# EAGLE design Carrier Board (EAGLE 9.6.1)

## Sheet 1 of 3: Sensors
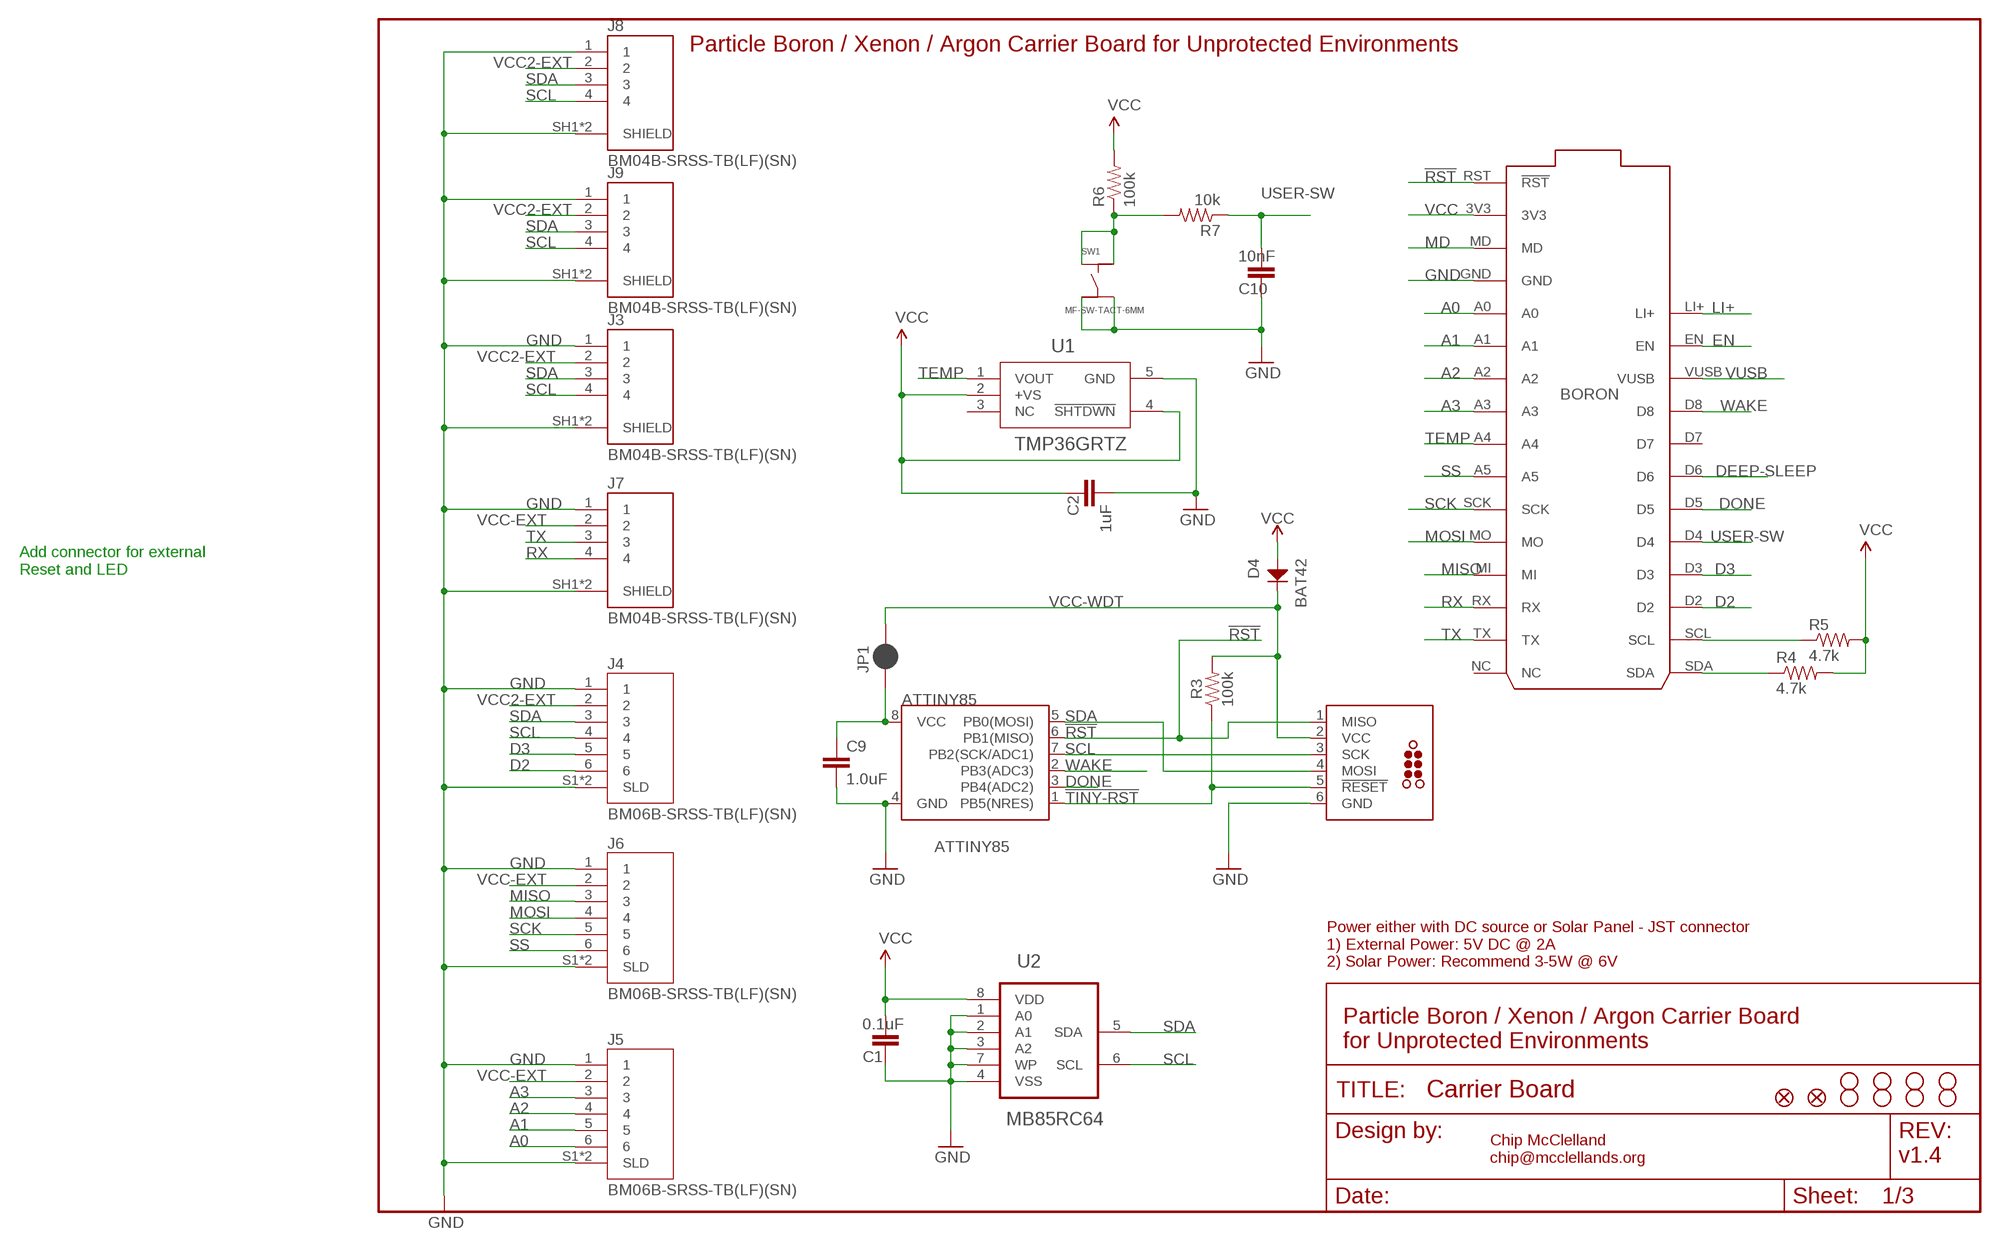
[diagram p0: schematic, sheet 1]

### Parts
ATTINY85  ATTINY85  ATTINY45  [SO08-EIAJ]
C1  0.1uF  CAP0805  [0805@1]
C2  1uF  CAP0805  [0805@1]
C9  1.0uF  1.0UF-0805-25V-10%  [0805]
C10  10nF  CAP0805  [0805@1]
D4  BAT42  DIODES_BAT42_SOD-123  [SOD-123]
FD1  FIDUCIALUFIDUCIAL  [FIDUCIAL-MICRO]
FD2  FIDUCIALUFIDUCIAL  [FIDUCIAL-MICRO]
FRAME1  FRAME-LETTER  [CREATIVE_COMMONS]
H1  STAND-OFF-M2.5  [STAND-OFF-M2.5]
H2  STAND-OFF-M2.5  [STAND-OFF-M2.5]
H3  STAND-OFF-M2.5  [STAND-OFF-M2.5]
H4  STAND-OFF-M2.5  [STAND-OFF-M2.5]
ICSP  TCP2030-MCP-NL  [TC2030-MCP-NL]
J3  BM04B-SRSS-TB(LF)(SN)  BM04B-SRSS-TBT(LF)(SN)  [CONN_BM04B-SRSS-TBT(LF)(SN)]
J4  BM06B-SRSS-TB(LF)(SN)  [JST_BM06B-SRSS-TB(LF)(SN)]
J5  BM06B-SRSS-TB(LF)(SN)  [JST_BM06B-SRSS-TB(LF)(SN)]
J6  BM06B-SRSS-TB(LF)(SN)  [JST_BM06B-SRSS-TB(LF)(SN)]
J7  BM04B-SRSS-TB(LF)(SN)  BM04B-SRSS-TBT(LF)(SN)  [CONN_BM04B-SRSS-TBT(LF)(SN)]
J8  BM04B-SRSS-TB(LF)(SN)  BM04B-SRSS-TBT(LF)(SN)  [CONN_BM04B-SRSS-TBT(LF)(SN)]
J9  BM04B-SRSS-TB(LF)(SN)  BM04B-SRSS-TBT(LF)(SN)  [CONN_BM04B-SRSS-TBT(LF)(SN)]
JP1  JUMPER-SMT_2_NC_PASTE_SILK  [SMT-JUMPER_2_NC_PASTE_SILK]
JP3  STAND-OFF  [STAND-OFF]
JP4  STAND-OFF  [STAND-OFF]
JP5  STAND-OFF  [STAND-OFF]
JP6  STAND-OFF  [STAND-OFF]
P1  Particle Boron / Xenon / Argon  PARTICLE-DEVICES-BORON  [PARTICLE-DEVICES_BORON]
R3  100k  0.3OHM-0805-1/8W-1%  [0805]
R4  4.7k  RESISTOR0805-RES  [0805]
R5  4.7k  RESISTOR0805-RES  [0805]
R6  100k  RESISTOR0805-RES  [0805]
R7  10k  RESISTOR0805-RES  [0805]
SW1  MF-SW-TACT-6MM  TACT_6MM  [TACT6MM]
U1  TMP36GRTZ  TMP36GRTZ-REEL7  [RJ_5]
U2  MB85RC64  MB85RC128PNF-G-JNE1  [SOIC127P600X175-8N]

### Nets
!RST: ATTINY85.6(PB1(MISO)) ICSP.1(MISO) P1.RST(!RST)
!TINY-RST: ATTINY85.1(PB5(NRES)) ICSP.5(!RESET) R3.1
A0: J5.6 P1.A0
A1: J5.5 P1.A1
A2: J5.4 P1.A2
A3: J5.3 P1.A3
D2: J4.6 P1.D2 ; also sheet 2
D3: J4.5 P1.D3 ; also sheet 2
DEEP-SLEEP: P1.D6
DONE: ATTINY85.3(PB4(ADC2)) P1.D5
EN: P1.EN ; also sheet 3
GND: ATTINY85.4(GND) C1.2 C2.2 C9.2 C10.2 ICSP.6(GND) J3.1 J3.SH1(SHIELD) J3.SH2(SHIELD) J4.1 J4.S1(SLD) J4.S2(SLD) J5.1 J5.S1(SLD) J5.S2(SLD) J6.1 J6.S1(SLD) J6.S2(SLD) J7.1 J7.SH1(SHIELD) J7.SH2(SHIELD) J8.1 J8.SH1(SHIELD) J8.SH2(SHIELD) J9.1 J9.SH1(SHIELD) J9.SH2(SHIELD) P1.GND SW1.P$3 SW1.P$4 U1.5(GND) U2.1(A0) U2.2(A1) U2.3(A2) U2.4(VSS) U2.7(WP) ; also sheet 2,3
LI+: P1.LI+ ; also sheet 2
MD: P1.MD
MISO: J6.3 P1.MI
MOSI: J6.4 P1.MO
N$4: R6.1 R7.2 SW1.P$1 SW1.P$2
N$8: ATTINY85.8(VCC) C9.1 JP1.1
RX: J7.4 P1.RX
SCK: J6.5 P1.SCK
SCL: ATTINY85.7(PB2(SCK/ADC1)) ICSP.3(SCK) J3.4 J4.4 J8.4 J9.4 P1.SCL R5.1 U2.6(SCL) ; also sheet 2,3
SDA: ATTINY85.5(PB0(MOSI)) ICSP.4(MOSI) J3.3 J4.3 J8.3 J9.3 P1.SDA R4.1 U2.5(SDA) ; also sheet 2,3
SS: J6.6 P1.A5
TEMP: P1.A4 U1.1(VOUT)
TX: J7.3 P1.TX
USER-SW: C10.1 P1.D4 R7.1
VCC: C1.1 C2.1 D4.ANODE P1.3V3 R4.2 R5.2 R6.2 U1.2(+VS) U1.4(!SHTDWN) U2.8(VDD) ; also sheet 2,3
VCC2-EXT: J3.2 J4.2 J8.2 J9.2 ; also sheet 2
VCC-EXT: J5.2 J6.2 J7.2 ; also sheet 2
VCC-WDT: D4.CATHODE ICSP.2(VCC) JP1.2 R3.2
VUSB: P1.VUSB ; also sheet 2
WAKE: ATTINY85.2(PB3(ADC3)) P1.D8
Unconnected: P1.D7 P1.NC U1.3(NC)

### Notes on the sheet
- Particle Boron / Xenon / Argon Carrier Board for Unprotected Environments
- Add connector for external 
  Reset and LED
- Power either with DC source or Solar Panel - JST connector
  1) External Power: 5V DC @ 2A 
  2) Solar Power: Recommend 3-5W @ 6V
- Particle Boron / Xenon / Argon Carrier Board
  for Unprotected Environments
- Chip McClelland
  chip@mcclellands.org
- v1.4

## Sheet 2 of 3: Power Control
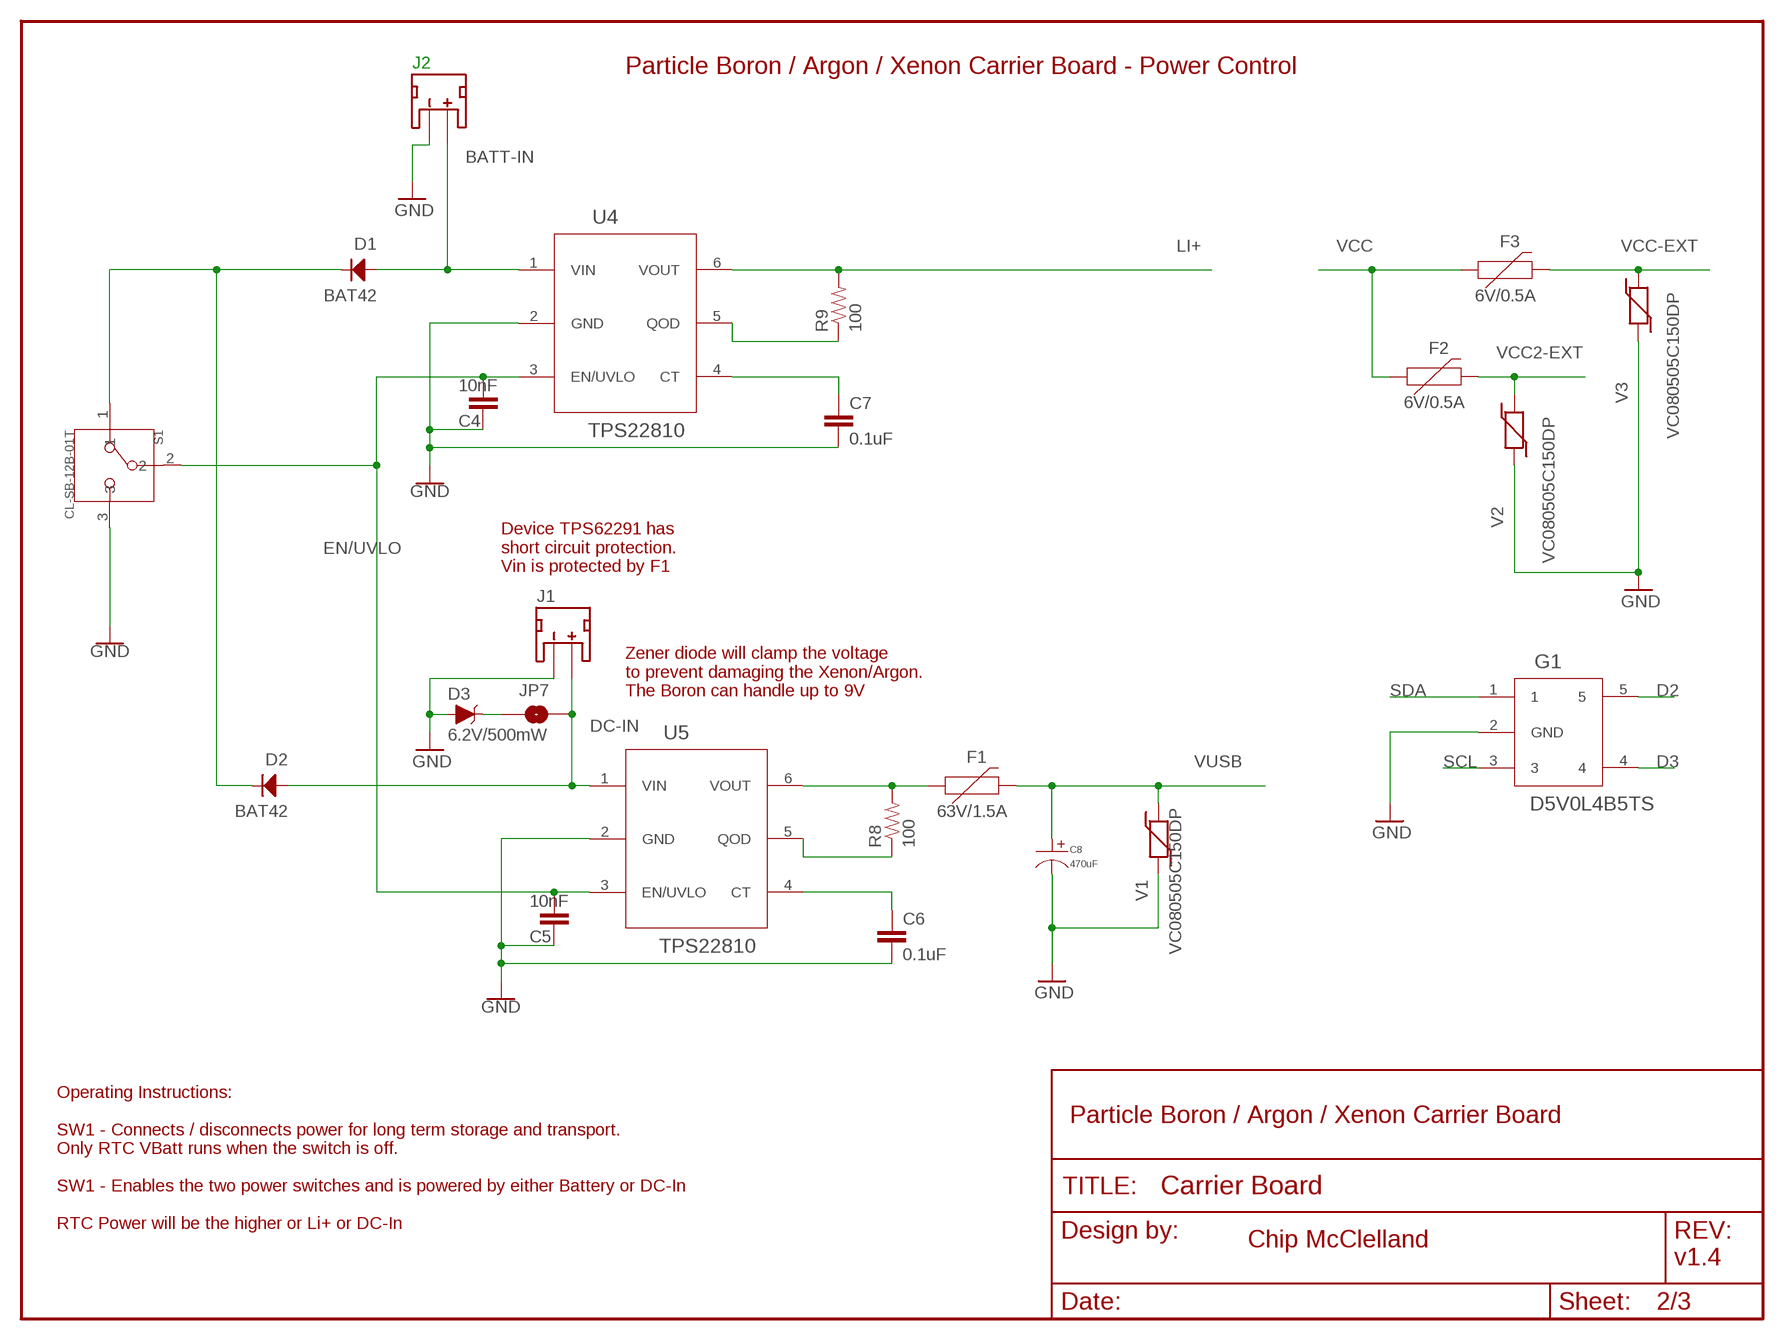
[diagram p1: schematic, sheet 2]

### Parts
C4  10nF  CAP0805  [0805@1]
C5  10nF  CAP0805  [0805@1]
C6  0.1uF  CAP0805  [0805@1]
C7  0.1uF  CAP0805  [0805@1]
C8  470uF  CAPACITOR_P_10MM  [CP10MM]
D1  BAT42  DIODES_BAT42_SOD-123  [SOD-123]
D2  BAT42  DIODES_BAT42_SOD-123  [SOD-123]
D3  6.2V/500mW  DIODE-ZENER-DZ2J150M0L  [PANASONIC_SMINI2-F5-B]
F1  63V/1.5A  PPTC_HALF-AMP  [1206]
F2  6V/0.5A  PPTC_HALF-AMP  [1206]
F3  6V/0.5A  PPTC_HALF-AMP  [1206]
FRAME2  FRAME-LETTER  [CREATIVE_COMMONS]
G1  D5V0L4B5TS  [SOT-23-5]
J1  S2B-PH-SM4-TB(LF)(SN)  JST_2MM_MALE  [JST-2-SMD]
J2  S2B-PH-SM4-TB(LF)(SN)  JST_2MM_MALE  [JST-2-SMD]
JP7  JUMPER-SMT_2_NO_SILK  [SMT-JUMPER_2_NO_SILK]
R8  100  RESISTOR0805-RES  [0805]
R9  100  RESISTOR0805-RES  [0805]
S1  CL-SB-12B-01T  [CL-SB-12B]
U4  TPS22810  [SOT-23-6]
U5  TPS22810  [SOT-23-6]
V1  VC080505C150DP  VARISTOR  [0805]
V2  VC080505C150DP  VARISTOR  [0805]
V3  VC080505C150DP  VARISTOR  [0805]

### Nets
BATT-IN: D1.ANODE J2.2(+) U4.1(VIN) ; also sheet 3
D2: G1.5 ; also sheet 1
D3: G1.4 ; also sheet 1
DC-IN: D2.ANODE J1.2(+) JP7.1 U5.1(VIN)
EN/UVLO: C4.1 C5.1 S1.2 U4.3(EN/UVLO) U5.3(EN/UVLO)
GND: C4.2 C5.2 C6.2 C7.2 C8.P$2 D3.A G1.2(GND) J1.1(-) J2.1(-) S1.3 U4.2(GND) U5.2(GND) V1.1 V2.1 V3.1 ; also sheet 1,3
LI+: R9.2 U4.6(VOUT) ; also sheet 1
N$1: D3.C JP7.2
N$5: C6.1 U5.4(CT)
N$6: R8.1 U5.5(QOD)
N$7: F1.1 R8.2 U5.6(VOUT)
N$9: D1.CATHODE D2.CATHODE S1.1
N$10: C7.1 U4.4(CT)
N$12: R9.1 U4.5(QOD)
SCL: G1.3 ; also sheet 1,3
SDA: G1.1 ; also sheet 1,3
VCC: F2.1 F3.1 ; also sheet 1,3
VCC2-EXT: F2.2 V2.2 ; also sheet 1
VCC-EXT: F3.2 V3.2 ; also sheet 1
VUSB: C8.P$1 F1.2 V1.2 ; also sheet 1
Unconnected: J1.NC1(PAD1) J1.NC2(PAD2) J2.NC1(PAD1) J2.NC2(PAD2)

### Notes on the sheet
- Particle Boron / Argon / Xenon Carrier Board - Power Control
- Device TPS62291 has 
  short circuit protection. 
  Vin is protected by F1
- Zener diode will clamp the voltage
  to prevent damaging the Xenon/Argon.  
  The Boron can handle up to 9V
- Particle Boron / Argon / Xenon Carrier Board
- Operating Instructions:
  
  SW1 - Connects / disconnects power for long term storage and transport.  
  Only RTC VBatt runs when the switch is off.
  
  SW1 - Enables the two power switches and is powered by either Battery or DC-In
  
  RTC Power will be the higher or Li+ or DC-In
- Chip McClelland
- v1.4

## Sheet 3 of 3: Real Time Clock
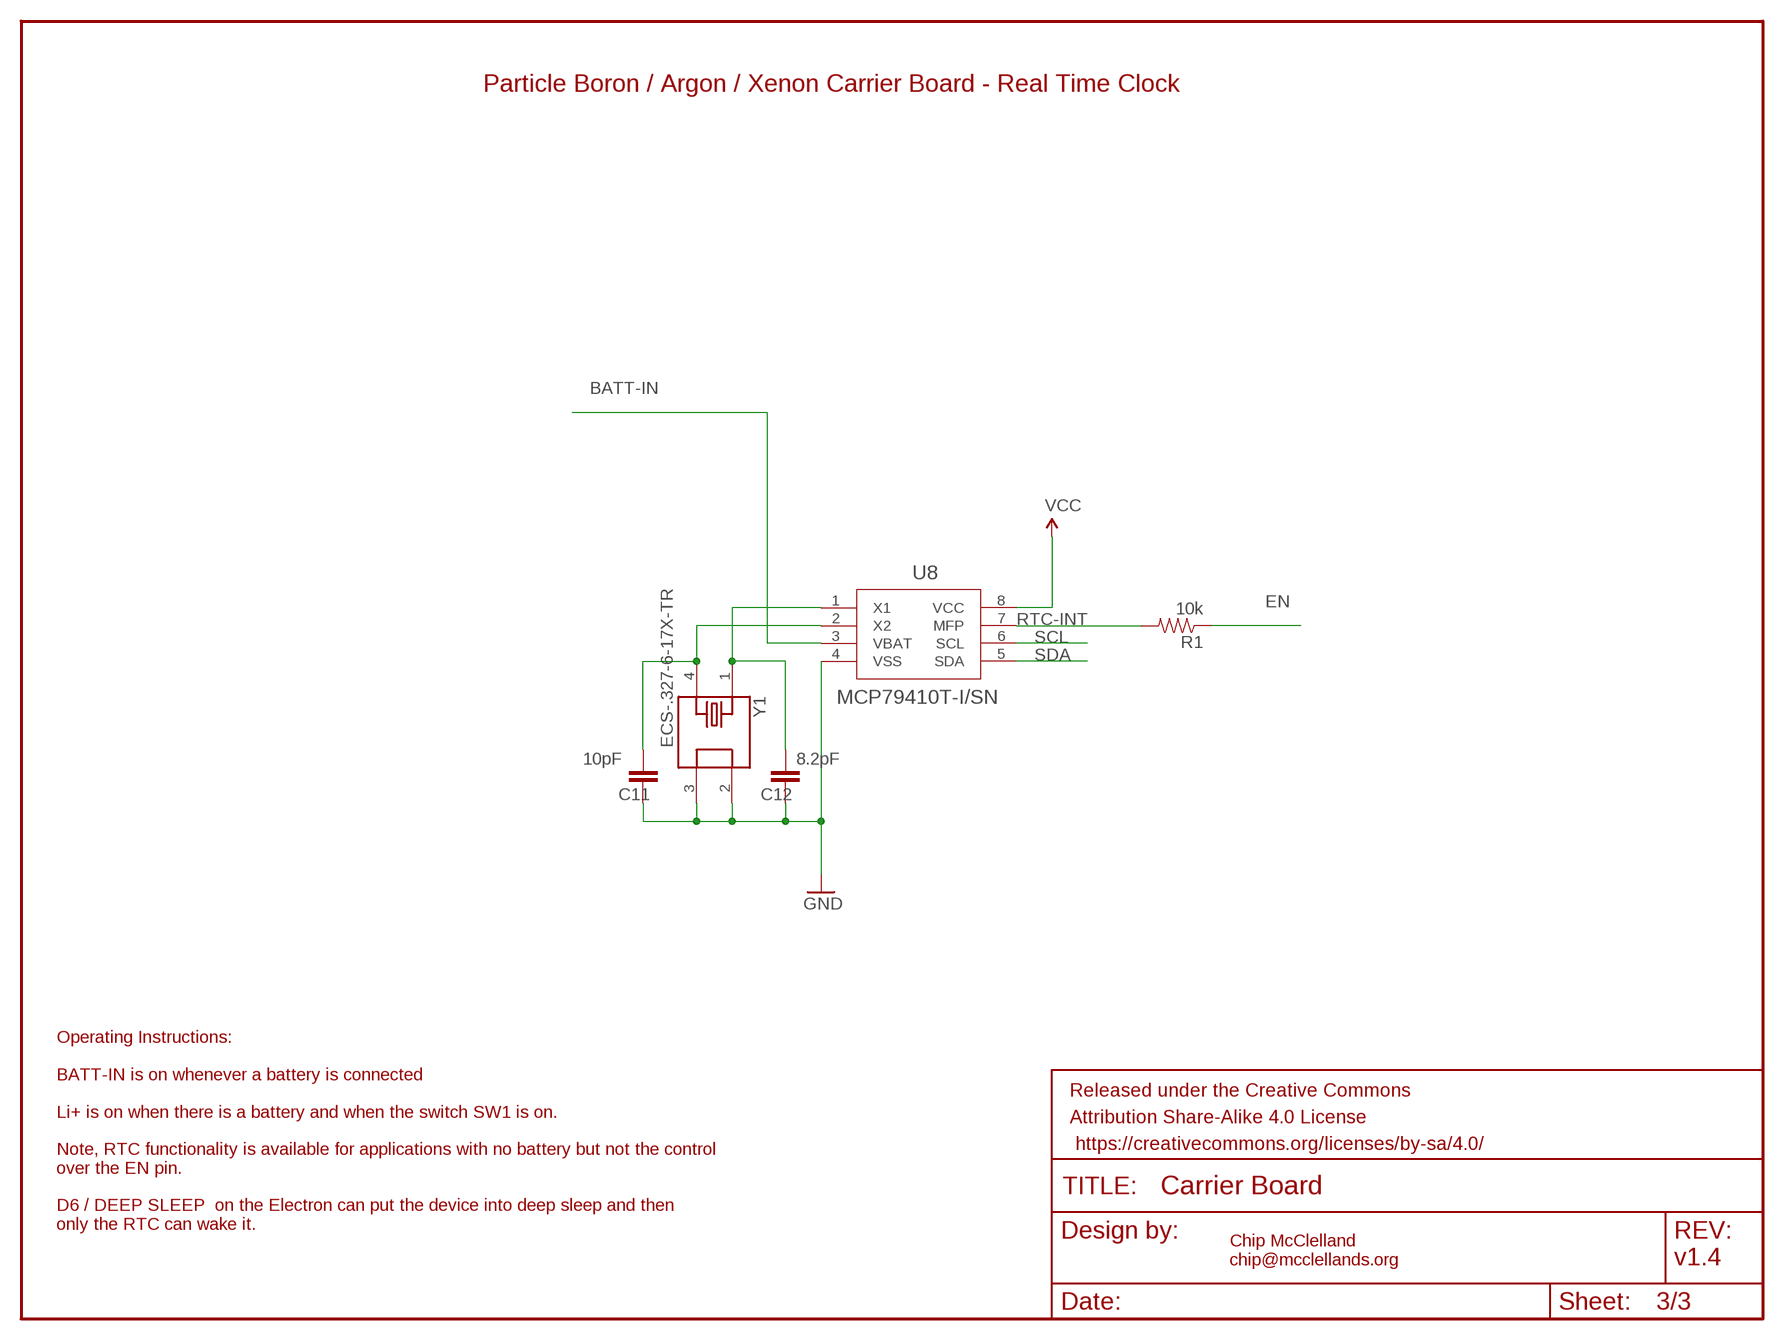
[diagram p2: schematic, sheet 3]

### Parts
C11  10pF  CAP0805  [0805@1]
C12  8.2pF  CAP0805  [0805@1]
FRAME3  FRAME-LETTER  [CREATIVE_COMMONS]
R1  10k  RESISTOR0805-RES  [0805]
U8  MCP79410T-I/SN  [SOIC8-N_MC]
Y1  ECS-.327-6-17X-TR  [XTAL_ECS-.327-6-17X-TR]

### Nets
BATT-IN: U8.3(VBAT) ; also sheet 2
EN: R1.1 ; also sheet 1
GND: C11.2 C12.2 U8.4(VSS) Y1.2 Y1.3 ; also sheet 1,2
N$15: C12.1 U8.1(X1) Y1.1
N$16: C11.1 U8.2(X2) Y1.4
RTC-INT: R1.2 U8.7(MFP)
SCL: U8.6(SCL) ; also sheet 1,2
SDA: U8.5(SDA) ; also sheet 1,2
VCC: U8.8(VCC) ; also sheet 1,2

### Notes on the sheet
- Particle Boron / Argon / Xenon Carrier Board - Real Time Clock
- Operating Instructions:
  
  BATT-IN is on whenever a battery is connected
  
  Li+ is on when there is a battery and when the switch SW1 is on.
  
  Note, RTC functionality is available for applications with no battery but not the control
  over the EN pin.
  
  D6 / DEEP SLEEP  on the Electron can put the device into deep sleep and then 
  only the RTC can wake it.
- Chip McClelland
  chip@mcclellands.org
- v1.4

## Library data of the parts
ATTINY85 = SparkFun:ATTINY45: Atmel ATTiny45; MPN: ATTINY85-20SUR
C1 = SparkFun-Capacitors:CAP: Capacitor Standard 0603 ceramic capacitor, and 0.1" leaded capacitor.; HOUSEPART: YES; MPN: MF-CAP-0805-0.1uF; POPULATE: 1
C2 = SparkFun-Capacitors:CAP: Capacitor Standard 0603 ceramic capacitor, and 0.1" leaded capacitor.; MPN: MF-CAP-0805-1uF
C4 C5 C10 = SparkFun-Capacitors:CAP: Capacitor Standard 0603 ceramic capacitor, and 0.1" leaded capacitor.; HOUSEPART: No; MPN: 08051C103K4T2A; POPULATE: 1
C6 C7 = SparkFun-Capacitors:CAP: Capacitor Standard 0603 ceramic capacitor, and 0.1" leaded capacitor.; HOUSEPART: Yes; MPN: MF-CAP-0805-0.1uF
C8 = MF_Passives:CAPACITOR_P: Library: MF_Passives Description: Device for Polarized Capacitors. Manufacture part number (MPN), Voltage Rating, and Tolerance can be added via Attributes. Check https://factory.macrofab.com/parts for the house parts list.; HOUSEPART: 1; MPN: MF-CAP-10MM-470uF; POPULATE: 1
C9 = SparkFun-Capacitors:1.0UF: 1µF ceramic capacitors A capacitor is a passive two-terminal electrical component used to store electrical energy temporarily in an electric field.; MPN: MF-CAP-0805-0.1uF; PROD_ID: CAP-08064
C11 = SparkFun-Capacitors:CAP: Capacitor Standard 0603 ceramic capacitor, and 0.1" leaded capacitor.; HOUSEPART: No; MPN: C0805C100JDGACTU‎; POPULATE: 1
C12 = SparkFun-Capacitors:CAP: Capacitor Standard 0603 ceramic capacitor, and 0.1" leaded capacitor.; HOUSEPART: No; MPN: C0805C829D5GACTU‎; POPULATE: 1
D1 D2 D4 = MF_Discrete_Semiconductor:DIODES: Library: MF_Discrete_Semiconductor Description: Device for Single Packaged Diodes.; HOUSEPART: YES; MPN: MF-DIO-SOD123-BAT42; POPULATE: 1; URL: https://factory.macrofab.com/part/MF-DIO-SOD123-BAT42; VALUE: MF-DIO-SOD123-BAT42
D3 = SparkFun-DiscreteSemi:DIODE-ZENER: Zener Diode A Zener diode allows current to flow from its anode to its cathode like a normal semiconductor diode, but it also permits current to flow in the reverse direction when its "Zener voltage" is reached. - WIkipedia; MPN: TDZ6V2J,115; POPULATE: 1; PROD_ID: DIO-12989; VALUE: 15V
F1 = SparkFun-Fuses:PPTC: Resettable Fuse PPTC Resettable Fuse. Really a sort of resistor with a polymeric positive temperature coefficient whose resistance increases dramatically with an increase in temperature. When heated by the power passing through the resistance rises causing the current to be limited, protecting the circuit. This is achieved by the transition of the polymer from a crystalline to an amorphous state where the conductive carbon separates breaking the conductive pathways found in the cool crystalline structure. When a PPTC cools back down it resumes conducting letting the circuit turn back on. SparkFun Products: SparkFun RedBoard - Programmed with Arduino <https://www.sparkfun.com/products/12757> Pro Micro - 5V/16MHz <https://www.sparkfun.com/products/12640> Arduino Pro 328 - 5V/16MHz <https://www.sparkfun.com/products/10915> MP3 Trigger <https://www.sparkfun.com/products/13720>; MPN: 046801.5NR; PROD_ID: RES-08585; VALUE: 6V/0.5A
F2 F3 = SparkFun-Fuses:PPTC: Resettable Fuse PPTC Resettable Fuse. Really a sort of resistor with a polymeric positive temperature coefficient whose resistance increases dramatically with an increase in temperature. When heated by the power passing through the resistance rises causing the current to be limited, protecting the circuit. This is achieved by the transition of the polymer from a crystalline to an amorphous state where the conductive carbon separates breaking the conductive pathways found in the cool crystalline structure. When a PPTC cools back down it resumes conducting letting the circuit turn back on. SparkFun Products: SparkFun RedBoard - Programmed with Arduino <https://www.sparkfun.com/products/12757> Pro Micro - 5V/16MHz <https://www.sparkfun.com/products/12640> Arduino Pro 328 - 5V/16MHz <https://www.sparkfun.com/products/10915> MP3 Trigger <https://www.sparkfun.com/products/13720>; MPN: 0466.500NR; PROD_ID: RES-08585
FD1 FD2 = SparkFun-Aesthetics:FIDUCIAL: Fiducial Alignment Points Point-of-reference for pick-and-place machines and other optical instruments.; POPULATE: 0
FRAME1-FRAME3 = SparkFun-Aesthetics:FRAME-LETTER: Schematic Frame - Letter Standard 8.5x11 US Letter frame; POPULATE: 0
G1 = Custom Components:D5V0L4B5TS: 4 CHANNEL LOW CAPACITANCE BI-DIRECTIONAL TVS ARRAY; MPN: D5V0L4B5TS-7
H1-H4 = Custom Components:STAND-OFF-M2.5: Stand Off Drill holes for mechanically mounting via screws, standoffs, etc. Note: Use the keepout ring to avoid running the screw head into surrounding components. Variant Overviews STAND-OFF - Mechanical footprint for a M2.5 phillips button head screw. STAND-OFF-TIGHT - Mechanical footprint for a M2.5 phillips button head screw, Example SparkFun Products; POPULATE: 0
ICSP = Custom Components:TCP2030-MCP-NL; POPULATE: 0
J1 J2 = SparkFun-Connectors:JST_2MM_MALE: JST 2MM MALE RA CONNECTOR Two pin, compact surface mount connector. Commonly used as a battery input connection point. We really like the solid locking feeling and high current rating on these small connectors. We use these all the time as battery connectors. Mates to single-cell LiPo batteries. Here is the connector we sell at SparkFun: JST Right Angle Connector - White <https://www.sparkfun.com/products/8612> (PRT-08612) Datasheet <http://www.sparkfun.com/datasheets/Prototyping/Connectors/JST-Horizontal.pdf> It was used on these SparkFun products: SparkFun MOSFET Power Controller <https://www.sparkfun.com/products/11214> (PRT-11214) SparkFun Battery Babysitter - LiPo Battery Manager <https://www.sparkfun.com/products/13777> (PRT-13777) And many, many others that required a lipo battery connection.; MFG: JST S2B-PH-SM4-TB(LF)(SN); PROD_ID: CONN-11443; SF_ID: PRT-08612
J3 J7-J9 = Custom Components:BM04B-SRSS-TBT(LF)(SN): 1.0mm Pitch, Ultra-Compact, Low Profile Design, Interchangeable Shrouded Header; AVAILABILITY: Unavailable; DESCRIPTION: 1.0mm Pitch, Ultra-Compact, Low Profile Design, Interchangeable Shrouded Header; MF: JST Sales; MP: BM04B-SRSS-TB_LF__SN_; PACKAGE: None; PRICE: None
J4-J6 = Custom Components:BM06B-SRSS-TB(LF)(SN): 6 Position 1.0mm Top-Entry Surface Mount Shrouded Header; MPN: BM06B-SRSS-TB(LF)(SN); POPULATE: 1
JP1 = SparkFun-Jumpers:JUMPER-SMT_2_NC_PASTE: Normally closed solder jumper This jumper has an aperture in the stencil to allow solder paste to bridge the split in the wire so it's normally closed (NC). Wick off the solder to open the connection. Reapply solder to reclose the connection.; POPULATE: 0
JP3-JP6 = SparkFun-Hardware:STAND-OFF: Stand Off Drill holes for mechanically mounting via screws, standoffs, etc. Note: Use the keepout ring to avoid running the screw head into surrounding components. Variant Overviews STAND-OFF - Mechanical footprint for a #4 phillips button head screw. STAND-OFF-TIGHT - Mechanical footprint for a #4 phillips button head screw, Example SparkFun Products Screw - Phillips Head (1/4", 4-40, 10 pack) <https://www.sparkfun.com/products/10453> (PRT-10453) Screw - Phillips Head (1/2", 4-40, 10 pack) <https://www.sparkfun.com/products/10452> (PRT-10452) Screw - Phillips Head (3/4", 4-40, 10 pack) <https://www.sparkfun.com/products/10451> (PRT-10451) Screw - Phillips Head (1", 4-40, 10 pack) <https://www.sparkfun.com/products/10450> (PRT-10450); POPULATE: 0
JP7 = SparkFun-Jumpers:JUMPER-SMT_2_NO: Normally open jumper This jumper has two pads in close proximity to each other. Apply solder to close the connection. Round pads are easier to solder for beginners, but are a lot larger. SparkFun Product that uses the round pads: SparkFun EL Sequencer <https://www.sparkfun.com/products/12781>; POPULATE: 0
P1 = Carrier Board:PARTICLE-DEVICES-BORON: Particle Boron Device for Carrier Board Placement; POPULATE: 0
R1 R7 = SparkFun-Passives:RESISTOR: Resistor Basic schematic elements and footprints for 0603, 1206, and PTH resistors.; HOUSEPART: YES; MPN: MF-RES-0805-10K
R3 = SparkFun-Resistors:0.3OHM: 0.3Ω resistor A resistor is a passive two-terminal electrical component that implements electrical resistance as a circuit element. Resistors act to reduce current flow, and, at the same time, act to lower voltage levels within circuits. - Wikipedia; MPN: MF-RES-0805-100K; PROD_ID: RES-11622; VALUE: 0.3
R4 R5 = SparkFun-Passives:RESISTOR: Resistor Basic schematic elements and footprints for 0603, 1206, and PTH resistors.; MPN: MF-RES-0805-4.7K
R6 = SparkFun-Passives:RESISTOR: Resistor Basic schematic elements and footprints for 0603, 1206, and PTH resistors.; HOUSEPART: YES; MPN: MF-RES-0805-100K
R8 R9 = SparkFun-Passives:RESISTOR: Resistor Basic schematic elements and footprints for 0603, 1206, and PTH resistors.; HOUSEPART: Yes; MPN: MF-RES-0805-100
S1 = Custom Components:CL-SB-12B-01T; DESCRIPTION: Switch Slide N.O./N.C. SPDT Top Slide 0.2A 12VDC Gull Wing SMD T/R; DIGI-KEY_PART_NUMBER: 563-1318-1-ND; DIGI-KEY_PURCHASE_URL: https://www.digikey.com/product-detail/en/nidec-copal-electronics/CL-SB-12B-01T/563-1318-1-ND/3507878?utm_source=snapeda&utm_medium=aggregator&utm_campaign=symbol; MF: Nidec Copal; MP: CL-SB-12B-01T; PACKAGE: None
SW1 = MF_Switches:TACT: Library: MF_Switches Description: Device for Tact Switches. Manufacture part number (MFG#) can be added via Attributes.; HOUSEPART: YES; MPN: MF-SW-TACT-6MM; POPULATE: 1; URL: https://factory.macrofab.com/part/MF-SW-TACT-6MM
U1 = TMP36:TMP36GRTZ-REEL7; MANUFACTURER_PART_NUMBER: TMP36GRTZ-REEL7; MPN: TMP36GRTZ-REEL7; VENDOR: Analog Devices Inc
U2 = Fujitsu_By_element14_Batch_1:MB85RC128PNF-G-JNE1: Memory FRAM; MPN: MB85RC64APNF-G-JNERE1; OC_FARNELL: 1831995; OC_NEWARK: 93R5161; PACKAGE: SO-8; SUPPLIER: FUJITSU
U4 U5 = Custom Components:TPS22810: TPS22810, 2.7-18-V, 79-mΩOn-ResistanceLoadSwitchWithThermal Protection; MPN: TPS22810DBVT
U8 = Custom Components:MCP79410T-I/SN; MANUFACTURER_PART_NUMBER: MCP79410TISN; POPULATE: 1; VENDOR: Microchip
V1-V3 = Custom Components:VARISTOR; MPN: VC080505C150DP; POPULATE: 1
Y1 = Custom Components:ECS-.327-6-17X-TR: Crystal 4-SOJ, 5.50mm pitch; DESCRIPTION: ECX-306X Series 32.768 kHz ±20 ppm 6 pF -40 to +85 °C SMT Tuning Fork Crystal; DIGI-KEY_PART_NUMBER: XC1307CT-ND; DIGI-KEY_PURCHASE_URL: https://www.digikey.com/product-detail/en/ecs-inc/ECS-.327-6-17X-TR/XC1307CT-ND/827771?utm_source=snapeda&utm_medium=aggregator&utm_campaign=symbol; MF: ECS Inc.; MP: ECS-.327-6-17X-TR; PACKAGE: 4-4 ECS International

## Net classes
0 default: width 0.203 mm, drill 0.33 mm

## Board
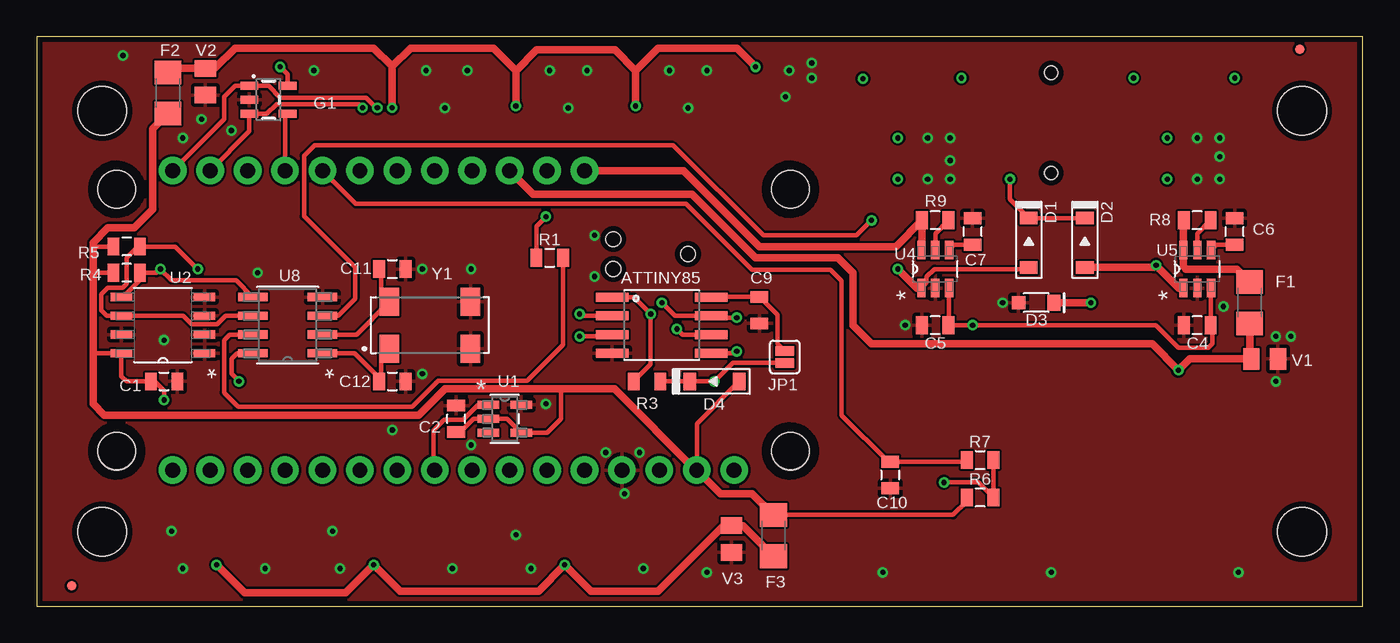
[diagram p3: board, top side]
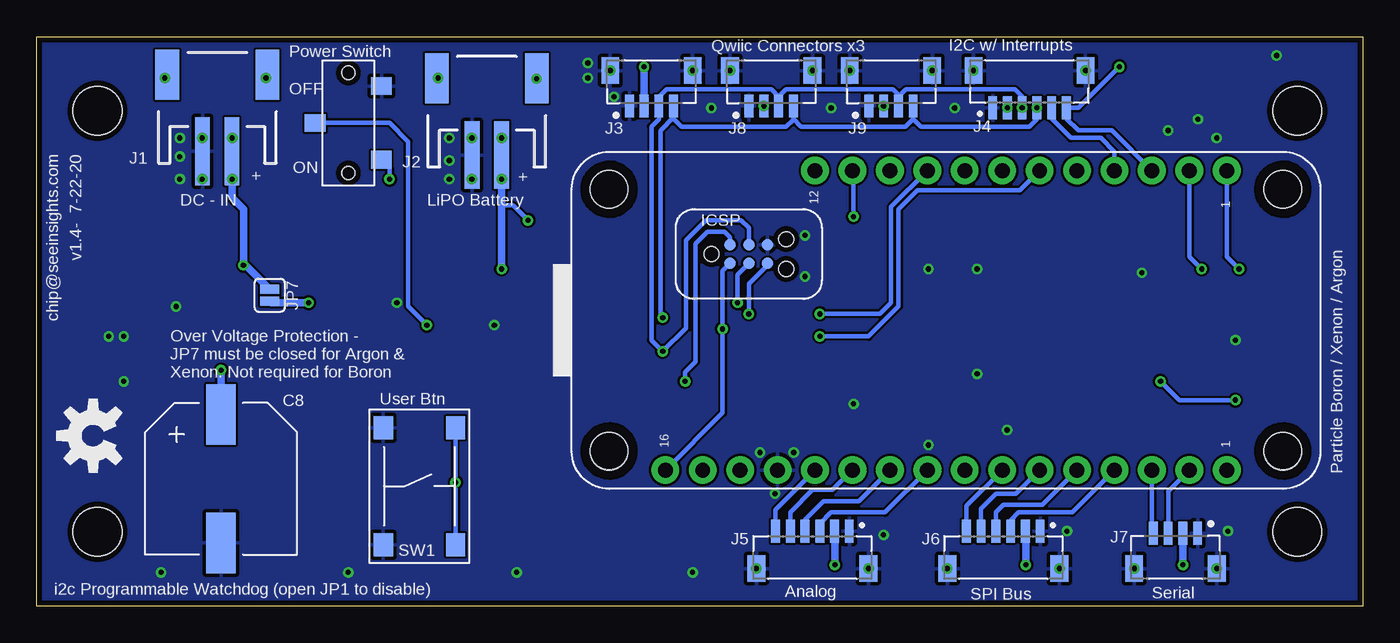
[diagram p4: board, bottom side, seen from below]

Size 89.97 x 38.61 mm. Coordinates in mm from the lower left corner, seen from the top.
Outline: 0,0 89.97,0 89.97,38.61 0,38.61 0,0
Copper layers (1*16): Top 0.0356mm / dielectric 1.5011mm / Bottom 0.0356mm
Design rules "LaenPCBOrder": minimum track width 6mil, minimum drill 13mil, track to track 6mil, track to pad 6mil, pad to pad 6mil, via to via 6mil, smd to smd 6mil, copper to edge 15mil, drill to drill 6mil, minimum pad ring 7mil, minimum via ring 7mil, stop-mask expansion 3mil, vias tented up to drill 0mil, thermal gap 10mil

### Footprints (pad centres in the part's own frame; a part is rotated, then mirrored left to right if it is on the bottom)
SO08-EIAJ = smd 0.61 x 2.21: 1 -1.905,-3.378; 2 -0.635,-3.378; 3 0.635,-3.378; 4 1.905,-3.378; 5 1.905,3.353; 6 0.635,3.353; 7 -0.635,3.353; 8 -1.905,3.353
0805@1 = smd 0.8 x 1.2: 1 -0.9,0; 2 0.9,0
CP10MM = smd 2 x 4.1: P$1 0,-4.35; P$2 0,4.35
0805 = smd 0.8 x 1.2: 1 -0.9,0; 2 0.9,0
SOD-123 = smd 0.85 x 1.2: ANODE 1.675,0; CATHODE -1.675,0
PANASONIC_SMINI2-F5-B = smd 0.9 x 0.9: A 1.2,0 | smd 0.9 x 1.1: C -1.2,0
1206 = smd 1.6 x 1.8: 1 -1.4,0; 2 1.4,0
FIDUCIAL-MICRO = smd 0.635 x 0.635: 1 0,0
SOT-23-5 = smd 0.55 x 1.2: 1 -0.95,-1.3; 2 0,-1.3; 3 0.95,-1.3; 4 0.95,1.3; 5 -0.95,1.3
STAND-OFF-M2.5 = hole 2.54: 0,0
TC2030-MCP-NL = smd 0.787 x 0.787: 1 -1.27,-0.635; 2 -1.27,0.635; 3 0,-0.635; 4 0,0.635; 5 1.27,-0.635; 6 1.27,0.635 | hole 0.991: -2.54,0; 2.54,-1.016; 2.54,1.016
JST-2-SMD = smd 1 x 4.6: 1 -1,-3.7; 2 1,-3.7 | smd 1.6 x 3.4: NC1 -3.4,1.5; NC2 3.4,1.5
CONN_BM04B-SRSS-TBT(LF)(SN) = smd 0.6 x 1.55: 1 -1.5,-2.4; 2 -0.5,-2.4; 3 0.5,-2.4; 4 1.5,-2.4 | smd 1.2 x 1.8: SH1 -2.8,0; SH2 2.8,0
JST_BM06B-SRSS-TB(LF)(SN) = smd 0.6 x 1.55: 1 -2.5,-2.525; 2 -1.5,-2.525; 3 -0.5,-2.525; 4 0.5,-2.525; 5 1.5,-2.525; 6 2.5,-2.525 | smd 1.2 x 1.8: S1 -3.8,0; S2 3.8,0
SMT-JUMPER_2_NC_PASTE_SILK = smd 0.635 x 1.27: 1 -0.406,0; 2 0.406,0
STAND-OFF = hole 3.302: 0,0
SMT-JUMPER_2_NO_SILK = smd 0.635 x 1.27: 1 -0.406,0; 2 0.406,0
PARTICLE-DEVICES_BORON = drill 1.016 pad 1.88: 3V3 1.27,41.91; A0 1.27,34.29; A1 1.27,31.75; A2 1.27,29.21; A3 1.27,26.67; A4 1.27,24.13; A5 1.27,21.59; D2 21.59,11.43; D3 21.59,13.97; D4 21.59,16.51; D5 21.59,19.05; D6 21.59,21.59; D7 21.59,24.13; D8 21.59,26.67; EN 21.59,31.75; GND 1.27,36.83; LI+ 21.59,34.29; MD 1.27,39.37; MI 1.27,13.97; MO 1.27,16.51; NC 1.27,6.35; RST 1.27,44.45; RX 1.27,11.43; SCK 1.27,19.05; SCL 21.59,8.89; SDA 21.59,6.35; TX 1.27,8.89; VUSB 21.59,29.21 | hole 2.54: 2.54,2.54; 20.32,2.54; 20.32,48.26; 2.54,48.26
CL-SB-12B = smd 1.2 x 1.4: 1 -2.5,-2.25; 2 0,2.25; 3 2.5,-2.25 | hole 0.9: 3.4,0; -3.4,0
TACT6MM = smd 1.55 x 1.3: P$1 -3.975,2.45; P$2 3.975,2.45; P$3 -3.975,-2.45; P$4 3.975,-2.45
RJ_5 = smd 1.473 x 0.559: 1 -1.118,0.95; 2 -1.118,0; 3 -1.118,-0.95; 4 1.118,-0.95; 5 1.118,0.95
SOIC127P600X175-8N = smd 1.473 x 0.559: 1 -2.819,1.905; 2 -2.819,0.635; 3 -2.819,-0.635; 4 -2.819,-1.905; 5 2.819,-1.905; 6 2.819,-0.635; 7 2.819,0.635; 8 2.819,1.905
SOT-23-6 = smd 1.27 x 0.559: 1 -1.295,0.94; 2 -1.295,0; 3 -1.295,-0.94; 4 1.295,-0.94; 5 1.295,0; 6 1.295,0.94
SOIC8-N_MC = smd 1.981 x 0.559: 1 -2.362,1.905; 2 -2.362,0.635; 3 -2.362,-0.635; 4 -2.362,-1.905; 5 2.362,-1.905; 6 2.362,-0.635; 7 2.362,0.635; 8 2.362,1.905
0805' = smd 1.118 x 1.448: 1 -0.902,0; 2 0.902,0
XTAL_ECS-.327-6-17X-TR = smd 1.3 x 1.9: 1 -2.75,-1.6; 2 2.75,-1.6; 3 2.75,1.6; 4 -2.75,1.6

### Placement (x,y rotation side)
ATTINY85  42.42,19.05 270 top
C1  8.64,15.24 0 top
C2  28.45,12.7 90 top
C4  78.74,19.05 180 top
C5  60.96,19.05 180 top
C6  81.28,25.4 90 top
C7  63.5,25.4 90 top
C8  77.47,8.64 180 bottom
C9  49.02,20.07 270 top
C10  57.91,8.89 270 top
C11  24.13,22.86 0 top
C12  24.13,15.24 0 top
D1  67.31,24.64 270 top
D2  71.12,24.64 270 top
D3  67.82,20.57 180 top
D4  45.97,15.24 0 top
F1  82.3,20.57 270 top
F2  8.89,34.8 90 top
F3  49.99,4.78 270 top
FD1  85.7,37.77 0 top
FD2  2.36,1.37 0 top
FRAME1  0.03,-11.81 0 top  (outside the outline)
FRAME2  -0.03,-7.98 0 top  (outside the outline)
FRAME3  90.42,19.28 0 top
G1  15.72,34.34 270 top
H1  5.41,10.52 0 top
H2  5.41,28.27 0 top
H3  51.13,10.52 0 top
H4  51.13,28.27 0 top
ICSP  41.66,23.88 0 bottom
J1  77.72,34.54 0 bottom
J2  59.44,34.29 0 bottom
J3  48.26,36.32 0 bottom
J4  22.61,36.32 0 bottom
J5  37.34,2.54 180 bottom
J6  24.38,2.54 180 bottom
J7  12.7,2.54 180 bottom
J8  40.13,36.32 0 bottom
J9  32,36.32 0 bottom
JP1  50.75,16.89 270 top
JP3  85.85,33.6 0 top
JP4  85.85,5.03 90 top
JP5  4.45,33.6 0 top
JP6  4.45,5.03 0 top
JP7  74.17,21.08 270 bottom
P1  2.87,7.95 90 bottom
R1  34.8,23.62 0 top
R3  41.4,15.24 0 top
R4  6.1,22.61 180 top
R5  6.1,24.38 180 top
R6  64.01,7.37 180 top
R7  64.01,9.91 0 top
R8  78.74,26.16 180 top
R9  60.96,26.16 180 top
S1  68.83,32.77 90 bottom
SW1  64.01,8.13 270 bottom
U1  31.75,12.7 0 top
U2  8.56,19.05 180 top
U4  60.96,22.86 90 top
U5  78.74,22.86 90 top
U8  17.02,19.05 180 top
U$2  [OSHW-LOGO-M]  86.16,11.56 90 bottom
V1  VC080505C150DP  [0805']  83.31,16.76 180 top
V2  VC080505C150DP  [0805']  11.43,35.56 90 top
V3  VC080505C150DP  [0805']  47.14,4.55 90 top
Y1  26.67,19.05 0 top

### Tracks (layer width: path | path; a pad name or v marks a point on that pad's centre or on a via)
!RST  (via drill 0.35)
  Top 0.305: ATTINY85.6 43.81,18.41 v43.43,18.8
  Bottom 0.305: ICSP.1 43.43,22.73 v43.43,18.8 43.43,13.11 P1.RST
!TINY-RST  (via drill 0.35)
  Top 0.305: ATTINY85.1 40.51,20.95 v41.66,19.81 41.66,16.39 R3.1
  Bottom 0.305: ICSP.5 40.39,23.11 41.66,21.84 v41.66,19.81
A0
  Bottom 0.305: P1.A0 39.84,6.54 J5.6
A1
  Bottom 0.305: P1.A1 35.97,7.87 37.34,7.87 38.84,6.37 J5.5
A2
  Bottom 0.305: P1.A2 34.19,7.11 36.58,7.11 37.84,5.85 J5.4
A3
  Bottom 0.305: P1.A3 32.41,6.35 36.07,6.35 36.84,5.58 J5.3
BATT-IN  (via drill 0.35)
  Top 0.305: U4.1 60.38,21.92 60.38,22.33 60.91,22.86 67.21,22.86 D1.ANODE | v56.64,26.16 55.63,25.15 49.31,25.15 43.16,31.24 18.85,31.24 18.14,30.55 18.14,26.43 21.59,22.98 21.59,20.83 20.45,19.68 U8.3
  Top 0.508: v58.42,22.86 59.72,21.57 U4.1
  Bottom 0.305: 58.42,27.18 57.66,27.18 v56.64,26.16 | 58.42,30.61 J2.2 58.44,28.96 | v58.42,31.75 58.42,30.61 | v58.42,28.96 58.42,30.61
  Bottom 0.508: 58.44,28.96 58.44,27.19 58.42,27.18 v58.42,22.86
D2  (via drill 0.35)
  Top 0.305: v16.51,36.58 17.02,36.06 G1.5
  Bottom 0.305: P1.D2 17.02,32.26 19.3,32.26 20.11,33.06 J4.6 19.29,33.8 v16.51,36.58
D3
  Top 0.305: G1.4 16.84,33.21 P1.D3
  Bottom 0.305: P1.D3 16.84,30.81 17.78,31.75 19.81,31.75 21.11,33.04 J4.5
DC-IN  (via drill 0.35)
  Top 0.508: U5.1 77.5,21.57 v75.95,23.11 75.8,22.96 D2.ANODE
  Bottom 0.305: v76.71,31.75 76.71,30.86 J1.2 76.71,30.83 v76.71,28.96
  Bottom 0.508: J1.2 76.72,27.7 75.95,26.92 v75.95,23.11 75.79,23.11 JP7.1
DONE  (via drill 0.35)
  Top 0.305: ATTINY85.3 38.91,18.29 v36.83,18.29
  Bottom 0.305: P1.D5 23.27,28.19 30.23,28.19 31.5,26.92 31.5,20.32 33.53,18.29 v36.83,18.29
EN  (via drill 0.35)
  Top 0.305: R1.1 33.9,25.77 v34.54,26.42
  Bottom 0.305: v34.54,26.42 34.54,29.46 P1.EN
EN/UVLO  (via drill 0.35)
  Top 0.305: U5.3 79.68,19.09 | 79.68,19.09 C4.1 | U4.3 61.9,19.09 | 61.9,19.09 C5.1 | 61.9,19.09 61.94,19.05 v63.5,19.05 75.95,19.05 77.47,17.53 79.5,17.53 79.76,17.78 79.76,19.01 79.68,19.09
  Bottom 0.305: v63.5,19.05 64.77,20.32 64.77,31.5 66.04,32.77 S1.2
GND  (via drill 0.35)
  other vias: 26.16,15.75 24.13,11.94 29.46,22.86 14.99,22.61 26.16,22.86 80.26,31.75 80.26,28.96 61.98,31.75 61.98,28.96 80.52,20.32 20.07,5.08 34.54,13.72 29.46,10.92 65.53,20.57 84.07,18.29 84.07,15.24 85.09,18.29 80.26,30.48 61.98,30.23 38.61,10.41 40.89,10.41 39.88,7.62 11.18,33.02 9.91,31.75 5.84,37.34 52.58,36.83 60.45,31.75 60.45,28.96 78.74,31.75 78.74,28.96 44.2,33.78 58.93,19.05 37.85,25.15 9.14,5.08 32.51,4.83 45.47,2.29 57.4,2.29 68.83,2.29 81.53,2.29 50.8,34.54 52.58,35.81 13.21,32.26 37.85,22.35 9.91,2.54 15.49,2.54 20.57,2.54 28.19,2.54 33.53,2.54 41.15,2.54 45.47,36.32 51.05,36.32 8.64,18.03 36.07,33.78 27.69,33.78 18.8,36.32 26.42,36.32 29.21,36.32 34.8,36.32 37.34,36.32 42.93,36.32
  pour Top (rank 2): -3.78,40.91 97.46,41.1 97.41,-4.03 -3.78,-4.22
  pour Bottom: -3.57,41.95 97.01,41.79 96.81,-3.18 -3.38,-3.15
LI+
  Top 0.508: P1.LI+ 43.87,29.54 49.02,24.38 58.28,24.38 R9.2 60.06,24.2 U4.6
MISO
  Bottom 0.305: P1.MI 19.71,6.35 23.37,6.35 23.88,5.83 J6.3
MOSI
  Bottom 0.305: P1.MO 21.74,6.86 24.38,6.86 24.89,6.35 24.89,5.07 J6.4
N$1  (via drill 0.35)
  Top 0.508: D3.C v71.53,20.57
  Bottom 0.508: JP7.2 74.07,20.57 v71.53,20.57
N$4  (via drill 0.35)
  Top 0.305: R7.2 R6.1 63.89,8.38 v61.56,8.38
  Bottom 0.305: SW1.P$1 v61.56,8.38 SW1.P$2
N$5
  Top 0.305: C6.1 80.02,24.5 U5.4
N$6
  Top 0.305: R8.1 78.74,25.26 U5.5
N$7
  Top 0.508: R8.2 77.8,26.12 U5.6 77.8,23.04 77.98,22.86 81.41,22.86 F1.1
N$8
  Top 0.305: ATTINY85.8 45.78,20.97 C9.1 50.24,19.75 50.24,17.8 JP1.1
N$9  (via drill 0.35)
  Top 0.305: D2.CATHODE D1.CATHODE 66.04,27.58 v66.04,28.96
  Bottom 0.305: S1.1 66.04,29.72 v66.04,28.96
N$10
  Top 0.305: U4.4 62.24,24.5 C7.1
N$12
  Top 0.305: R9.1 60.96,25.26 U4.5
N$15
  Top 0.305: U8.1 21.58,17.14 23.23,15.49 C12.1 23.37,15.49 23.37,17.02 Y1.1
N$16
  Top 0.305: U8.2 21.68,18.41 Y1.4 23.37,21.08 23.37,22.61 C11.1
N$17  (via drill 0.35)
  other vias: 74.42,35.81
N$18  (via drill 0.35)
  other vias: 81.28,35.81
NC1  (via drill 0.35)
  other vias: 62.74,35.81
NC2  (via drill 0.35)
  other vias: 56.06,35.76
RTC-INT
  Top 0.305: U8.7 13.08,18.41 12.7,18.03 12.7,14.48 13.66,13.51 25.45,13.51 27.23,15.29 33.27,15.29 35.7,17.71 R1.2
RX
  Bottom 0.305: P1.RX 14.3,5.04 J7.4
SCK
  Bottom 0.305: P1.SCK 23.52,7.62 24.89,7.62 25.91,6.6 25.91,5.09 J6.5
SCL  (via drill 0.35)
  Top 0.305: v47.5,19.56 45.9,19.56 ATTINY85.7 43.31,19.68 v42.42,20.57 | v10.92,22.86 9.4,24.38 R5.1 6.86,24.38 6.1,23.62 6.1,21.84 5.84,21.59 4.83,21.59 4.37,21.13 4.37,20.07 4.75,19.68 U2.6 9.93,19.68 10.52,19.1 12.24,19.1 12.83,19.68 U8.6 | J4.4 21.87,34.04 16.26,34.04 15.61,33.39 G1.3 14.42,32.2 P1.SCL
  Bottom 0.305: P1.SCL 11.76,23.7 v10.92,22.86 | ICSP.3 42.42,22.48 v42.42,20.57 | v47.5,19.56 47.65,19.71 47.65,32.25 46.76,33.14 J3.4 46.76,33.04 46.23,32.51 39.12,32.51 38.63,33 J8.4 38.63,33.04 38.1,32.51 31.01,32.51 30.5,33.02 J9.4 30.5,33.04 29.97,32.51 22.61,32.51 22.11,33.01 J4.4
  other vias: 22.11,33.8
SDA  (via drill 0.35)
  Top 0.305: ATTINY85.5 47.37,17.14 v47.5,17.27 | U2.5 5.92,21.13 6.03,21.13 7,22.1 R4.1 8.13,22.61 v8.38,22.86 9.14,22.1 13.51,22.1 U8.5 | P1.SDA 12.7,33.02 12.7,34.54 13.45,35.29 G1.1 15.54,35.29 15.72,35.29 16.51,34.49 22.34,34.49 23.04,33.8 J4.3
  Bottom 0.305: ICSP.4 41.66,25.65 42.18,26.18 44.57,26.18 45.92,24.83 45.92,18.85 v47.5,17.27 48.26,18.03 48.26,32.51 47.76,33.01 J3.3 47.76,34.54 47.24,35.05 40.13,35.05 39.63,34.55 J8.3 39.63,34.54 39.12,35.05 31.87,35.05 31.5,34.68 J9.3 31.5,34.54 30.99,35.05 23.6,35.05 23.11,34.56 J4.3 | P1.SDA 9.22,23.7 v8.38,22.86
  other vias: 23.11,33.8
SS
  Bottom 0.305: P1.A5 26.88,6.8 J6.6
TEMP
  Top 0.305: U1.1 29.93,13.65 28.92,12.64 27.63,12.64 26.92,11.94 26.92,9.3 P1.A4
TX
  Bottom 0.305: P1.TX 13.2,7.78 J7.3
USER-SW
  Top 0.305: P1.D4 21.64,27.28 44.06,27.28 48.54,22.81 53.85,22.81 54.61,22.05 54.61,12.95 57.77,9.79 C10.1 62.99,9.79 R7.1
VCC  (via drill 0.35)
  Top 0.305: 35.56,14.73 35.56,12.7 34.61,11.75 U1.4 31.92,12.7 U1.2 29.63,12.7 28.73,11.8 C2.1 | 3.81,17.27 3.94,17.14 U2.8 5.74,15.6 6.1,15.24 C1.1 7.99,15.24 8.64,14.59 v8.64,13.97 | F3.1 62.17,6.17 63.11,7.11 R6.2 | U8.8 13.59,17.14 13.21,16.76 13.21,15.75 v13.72,15.24 | R5.2 3.81,24.38 | R4.2 3.81,22.61 | P1.3V3 44.78,12.37 D4.ANODE
  Top 0.508: F3.1 48.54,7.62 46.38,7.62 P1.3V3 44.7,9.22 39.19,14.73 35.56,14.73 27.69,14.73 25.91,12.95 4.57,12.95 3.81,13.72 3.81,17.27 3.81,22.61 3.81,24.38 3.81,24.64 4.83,25.65 6.6,25.65 7.87,26.92 7.87,32.38 F2.1
  Bottom 0.305: v13.72,15.24 12.45,13.97 v8.64,13.97
VCC2-EXT  (via drill 0.35)
  Top 0.508: F2.2 9.15,36.46 V2.2 12.08,36.46 13.46,37.85 22.86,37.85 24.11,36.6 | v48.77,36.58 47.5,37.85 42.16,37.85 40.64,36.32 | 32.51,36.32 30.99,37.85 25.35,37.85 24.11,36.6 | 32.51,36.32 33.91,37.72 39.24,37.72 40.64,36.32 | J9.2 32.5,36.31 32.51,36.32 | J8.2 40.63,36.31 40.64,36.32 | J4.2 24.11,36.6
  Bottom 0.508: J3.2 48.76,36.57 v48.77,36.58
  other vias: 32.5,33.92 40.63,33.92 24.11,33.8
VCC-EXT  (via drill 0.35)
  Top 0.508: F3.2 47.91,5.45 V3.2 46.6,5.45 42.16,1.02 37.59,1.02 v35.81,2.79 34.04,1.02 24.64,1.02 v22.86,2.79 20.95,0.89 14.1,0.89 v12.19,2.79
  Bottom 0.508: v12.19,2.79 J7.2 | v22.86,2.79 22.86,5.04 J6.2 | J5.2 35.81,5.04 v35.81,2.79
VCC-WDT  (via drill 0.35)
  Top 0.305: R3.2 D4.CATHODE v45.97,15.24 47.24,16.51 50.75,16.51 JP1.2
  Bottom 0.305: ICSP.2 42.93,25.02 43.31,25.4 44.45,25.4 45.26,24.59 45.26,16.57 45.97,15.86 v45.97,15.24
VUSB  (via drill 0.35)
  Top 0.508: F1.2 82.3,16.88 V1.2 78.23,16.76 v77.47,16 75.69,17.78 56.64,17.78 55.37,19.05 55.37,22.61 54.36,23.62 48.77,23.62 44.45,27.94 33.68,27.94 P1.VUSB
  Bottom 0.508: C8.P$1 v77.47,16
WAKE  (via drill 0.35)
  Top 0.305: v36.83,19.81 36.96,19.68 ATTINY85.2
  Bottom 0.305: P1.D8 32,27.08 32,20.57 32.77,19.81 v36.83,19.81

### Text on the board
bNames: I2C w/ Interrupts | Qwiic Connectors x3 | Power Switch | OFF | v1.4- 7-22-20 | chip@seeinsights.com | + | ON | + | LiPO Battery | DC - IN | Over Voltage Protection - / JP7 must be closed for Argon & / Xenon. Not required for Boron | User Btn | Analog | i2c Programmable Watchdog (open JP1 to disable) | Serial | SPI Bus